# Altium schematic sheet motor.SchDoc
size A4; SheetNumber: 5; SheetTotal: 6
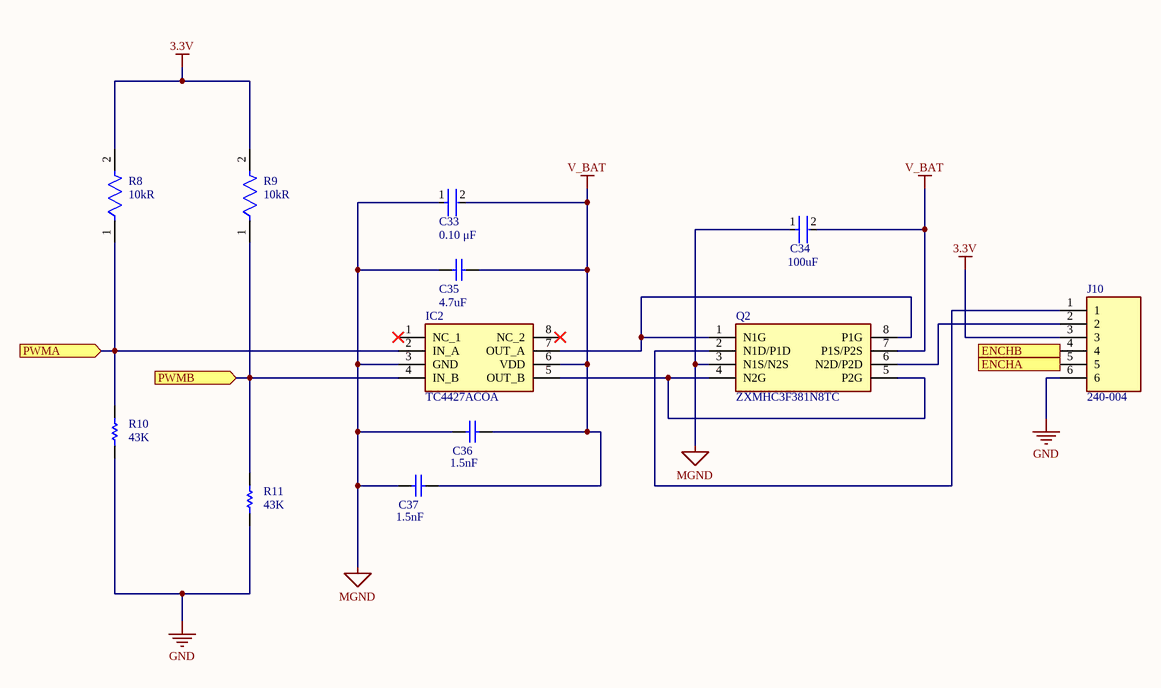
[diagram p0: motor.SchDoc]

## Parts
C33  value 0.10 μF  [FP-C0805C-DN-MFG]  (hidden comment: C0805C104J8RACTU)
C34  Capacitance: 100uF  [FP-C1206C-EH-MFG]  (hidden comment: C1206C107M9PACTU)
C35  value 4.7uF  [CAPC2013X145X50NL20T25]  (hidden comment: C0805C475M3PACTU)
C36  value 1.5nF  [CAPC2013X94X50NL20T25]  (hidden comment: 08051C152KAT2A)
C37  value 1.5nF  [CAPC2013X94X50NL20T25]  (hidden comment: 08051C152KAT2A)
IC2  TC4427ACOA  [SOIC127P600X175-8N]
J10  240-004  [HDRV6W64P0X254_1X6_1524X254X909P]
Q2  ZXMHC3F381N8TC  [SOIC127P600X170-8N]
R8  Resistance: 10kR  [FP-ERA3A-IPC_C]  (hidden comment: ERA-3AEB103V)
R9  Resistance: 10kR  [FP-ERA3A-IPC_C]  (hidden comment: ERA-3AEB103V)
R10  value 43K  [RESC1608X55X30ML20T20]  (hidden comment: ERA3AEB433V)
R11  value 43K  [RESC1608X55X30ML20T20]  (hidden comment: ERA3AEB433V)

## Ports
ENCHA (out), ENCHB (out), PWMA (in), PWMB (in)

## Nets
3.3V: J10.3 R8.2 R9.2
GND: J10.6 R10.1 R11.1
MGND: C33.1 C34.1 C35.1 C36.1 C37.1 IC2.3(GND) Q2.3(N1S/N2S)
V_BAT: C33.2 C34.2 C35.2 C36.2 C37.2 IC2.6(VDD) Q2.7(P1S/P2S)
ENCHA: J10.5 ; port ENCHA
ENCHB: J10.4 ; port ENCHB
PWMA: IC2.2(IN_A) R8.1 R10.2 ; port PWMA
PWMB: IC2.4(IN_B) R9.1 R11.2 ; port PWMB
NetIC2_5: IC2.5(OUT_B) Q2.4(N2G) Q2.5(P2G)
NetIC2_7: IC2.7(OUT_A) Q2.1(N1G) Q2.8(P1G)
NetJ10_1: J10.1 Q2.2(N1D/P1D)
NetJ10_2: J10.2 Q2.6(N2D/P2D)

Not connected (* = marked no-connect by the designer): IC2 1(NC_1)* 8(NC_2)*

## Library data of the parts
C33 = CMP-03020-032188-1: CAP CER 0.1UF 10V 5% X7R 0805; Manufacturer: KEMET; Material: Ceramic; Tolerance: 0.05; Temperature Coefficient: 30ppm/°C; Package: C0805C-DN; Device Class L1: Passive Components; Temperature: -55°C to +125°C; Category: Cap; RoHS: TRUE; Mouser Description: Multilayer Ceramic Capacitors MLCC - SMD/SMT 10volts 0.1uF X7R 5%; Lead Free: Yes; Temperature Range Low: -55°C; Temperature Range High: +125°C; Device Class L2: Capacitors; Temperature Characteristic: X7R; Device Class L3: Ceramic Capacitors; ComponentLink2Description: Datasheet; Automotive: No; Ipc Land Pattern Name: CAPC200125X78; Manufacturer Part Number: C0805C104J8RACTU; Voltage Rating: 10 V; Height: 0.88mm; Digikey Description: CAP CER 0.1UF 10V 5% X7R 0805; Octopart: https://octopart.com/c0805c104j8ractu-kemet-11807087; Capacitance: 0.10 μF; ComponentLink2URL: https://content.kemet.com/datasheets/KEM_C1003_C0G_SMD.pdf
C34 = CMP-1037-05005-3: CAP CER 100UF 6.3V X5R 1206; Dielectric Material: Ceramic; Tolerance: 2%; Dissipation Factor: 5%; Min Operating Temperature: -55°C; Case Code (Imperial): 1206; Case Code (Metric): 3216; Depth: 1.6mm; Dielectric: X5R; Max Operating Temperature: 85°C; Packaging: Tape and Reel; Construction: Flat; Series: C; Case/Package: 1206; Radiation Hardening: No; Voltage Rating (DC): 6.3V; Termination: SMD/SMT; Voltage Rating: 6.3V; Number of Pins: 2; RoHS Compliant: Yes; Height: 1.6mm; Lead Free: Lead Free; Voltage: 6.3V; REACH SVHC: No SVHC; Length: 3.2mm; Mount: Surface Mount; Package Quantity: 1; Thickness: 0.071inch; Width: 0.063inch
C35 = CMP-2007-01014-1: Manufacturer: Kemet; Part Number: C0805C475M3PACTU
C36 C37 = CMP-2007-04179-1: Manufacturer: AVX Interconnect / Elco; Part Number: 08051C152KAT2A
IC2 = TC4427ACOA: Integrated Circuit; Manufacturer_Name: Microchip; Datasheet Link: https://datasheet.datasheetarchive.com/originals/distributors/Datasheets-306/110017.pdf; Height: 1.75mm; Manufacturer_Part_Number: TC4427ACOA; Mouser Part Number: 579-TC4427ACOA; Mouser Price/Stock: https://www.mouser.co.uk/ProductDetail/Microchip-Technology/TC4427ACOA?qs=g6BBfX6YTklnRUZ4V7kDWA%3D%3D; Arrow Part Number: TC4427ACOA; Arrow Price/Stock: https://www.arrow.com/en/products/tc4427acoa/microchip-technology?utm_currency=USD&region=europe
J10 = 240-004: Connector; Manufacturer_Name: Digilent; Datasheet Link: https://digilent.com/reference/_media/reference/test-and-measurement/6-pin-header-gender-changer/163-068-2.pdf; Height: 9.09mm; Manufacturer_Part_Number: 240-004; Arrow Part Number: 240-004; Arrow Price/Stock: https://www.arrow.com/en/products/240-004/digilent?region=nac
Q2 = ZXMHC3F381N8TC: MOSFET (N-Channel); Manufacturer_Name: Diodes Incorporated; Datasheet Link: https://www.diodes.com//assets/Datasheets/ZXMHC3F381N8.pdf; Height: 1.7mm; Manufacturer_Part_Number: ZXMHC3F381N8TC; Mouser Part Number: 522-ZXMHC3F381N8TC; Mouser Price/Stock: https://www.mouser.co.uk/ProductDetail/Diodes-Incorporated/ZXMHC3F381N8TC?qs=7E5rbXJDVJoJr15tcLBfrA%3D%3D; Arrow Part Number: ZXMHC3F381N8TC; Arrow Price/Stock: https://www.arrow.com/en/products/zxmhc3f381n8tc/diodes-incorporated?region=nac
R8 R9 = CMP-2000-00874-2: RES SMD 10K OHM 0.1% 1/10W 0603; Voltage Rating (DC): 75V; Power Rating: 100mW; Temperature Coefficient: 25ppm/°C; Radiation Hardening: No; Width: 0.8mm; Depth: 0.8mm; Construction: Rectangular; Case Code (Metric): 1608; Package Quantity: 5000; Length: 1.6mm; Size Code: 0603; Case Code (Imperial): 0603; Termination: SMD/SMT; Contact Plating: Tin; Resistance Tolerance: 0.1%; Military Standard: Not; Packaging: Tape and Reel; Max Power Dissipation: 100mW; REACH SVHC: No SVHC; Series: ERA-3A; Voltage Rating: 75V; Lead Free: Lead Free; Technology: METAL FILM; RoHS Compliant: Yes; Max Operating Temperature: 155°C; Resistor Type: Thin Film; Min Operating Temperature: -55°C; Number of Pins: 2; Case/Package: 0603; Tolerance: 0.1%; Height: 0.45mm; Mount: Surface Mount; Number of Terminations: 2
R10 R11 = CMP-2000-00064-1: Manufacturer: Panasonic; Part Number: ERA3AEB433V